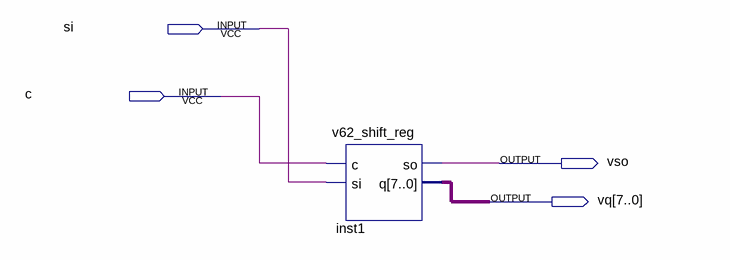
[diagram p0: schematic sheet]
// Quartus schematic sv62.bdf as structural Verilog: 1 symbols, 4 pins
module sv62 (
  input  si,
  input  c,
  output vso,
  output [7:0] vq
);

  v62_shift_reg inst1 (.c(c), .si(si), .so(vso), .q(vq));
endmodule
